# Altium schematic sheet 01_main.SchDoc: <Titel>
size A4; Date: <Erstelldatum>; DrawnBy: <Autor>; Organization: HSLU T&A; Address1: Abteilung Elektrotechnik; Address2: Technikumsstrasse 21; Address3: CH-6048 Horw; Revision: V1.0; SheetNumber: 1; SheetTotal: 1; Projektname: <Projektname>
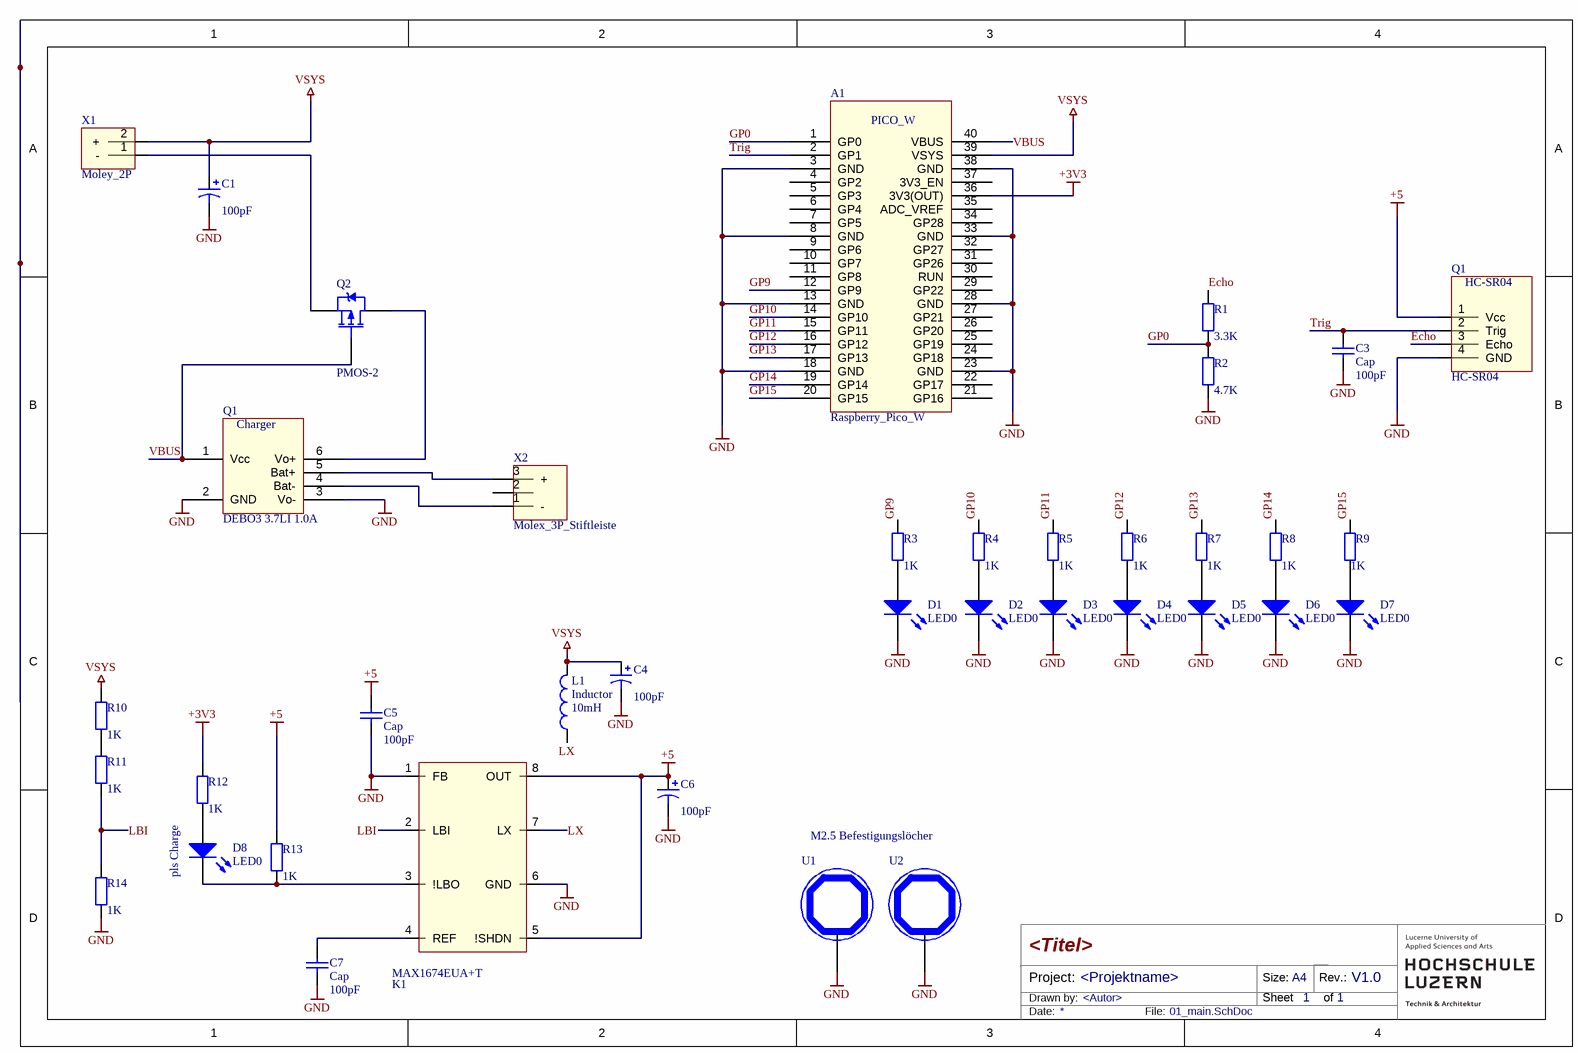
[diagram p0: 01_main.SchDoc]

## Parts
(Parts that share a designator on the sheet are numbered #1, #2 ... from top to bottom, then left to right.)
A1  Raspberry_Pico_W  [Raspi_Pico]
C1  value 100pF  [Elko_5mm]  (hidden comment: Cap Pol1)
C3  Cap  value 100pF  [C0603]
C4  value 100pF  [Elko_5mm]  (hidden comment: Cap Pol1)
C5  Cap  value 100pF  [C0603]
C6  value 100pF  [Elko_5mm]  (hidden comment: Cap Pol1)
C7  Cap  value 100pF  [C0603]
D1  LED0  [LED_5mm]
D2  LED0  [LED_5mm]
D3  LED0  [LED_5mm]
D4  LED0  [LED_5mm]
D5  LED0  [LED_5mm]
D6  LED0  [LED_5mm]
D7  LED0  [LED_5mm]
D8  LED0  [LED_5mm]
K1  MAX1674EUA+T  [uMAX_SOP8]
L1  Inductor  value 10mH  [AXIAL-0.5]
Q1#1  HC-SR04  [HC-SR04]
Q1#2  DEBO3 3.7LI 1.0A  [TP4056]
Q2  PMOS-2  [SOT-23]
R1  value 3.3K  [R0603]  (hidden comment: Res2)
R2  value 4.7K  [R0603]  (hidden comment: Res2)
R3  value 1K  [R0603]  (hidden comment: Res2)
R4  value 1K  [R0603]  (hidden comment: Res2)
R5  value 1K  [R0603]  (hidden comment: Res2)
R6  value 1K  [R0603]  (hidden comment: Res2)
R7  value 1K  [R0603]  (hidden comment: Res2)
R8  value 1K  [R0603]  (hidden comment: Res2)
R9  value 1K  [R0603]  (hidden comment: Res2)
R10  value 1K  [R0603]  (hidden comment: Res2)
R11  value 1K  [R0603]  (hidden comment: Res2)
R12  value 1K  [R0603]  (hidden comment: Res2)
R13  value 1K  [R0603]  (hidden comment: Res2)
R14  value 1K  [R0603]  (hidden comment: Res2)
U1  (no value)  [HoleM2.5]
U2  (no value)  [HoleM2.5]
X1  Moley_2P  [Molex Header 2P90]
X2  Molex_3P_Stiftleiste  [Molex_3P_Stiftleister]

## Nets
+3V3: A1.36(3V3(OUT)) R12.1
+5: C5.1 C6.1 K1.5(!SHDN) K1.8(OUT) Q1#1.1(Vcc) R13.1
GND: A1.3(GND) A1.8(GND) A1.13(GND) A1.18(GND) A1.23(GND) A1.28(GND) A1.33(GND) A1.38(GND) C1.2 C3.1 C4.2 C5.2 C6.2 C7.1 D1.2(K) D2.2(K) D3.2(K) D4.2(K) D5.2(K) D6.2(K) D7.2(K) K1.1(FB) K1.6(GND) Q1#1.4(GND) Q1#2.2(GND) Q1#2.3(Vo-) R2.2 R14.2 U1.?1 U2.?1
VSYS: A1.39(VSYS) C1.1 C4.1 L1.2 R10.1 X1.2(+)
Echo: Q1#1.3(Echo) R1.1
GP0: A1.1(GP0) R1.2 R2.1
GP9: A1.12(GP9) R3.1
GP10: A1.14(GP10) R4.1
GP11: A1.15(GP11) R5.1
GP12: A1.16(GP12) R6.1
GP13: A1.17(GP13) R7.1
GP14: A1.19(GP14) R8.1
GP15: A1.20(GP15) R9.1
LBI: K1.2(LBI) R11.2 R14.1
LX: K1.7(LX) L1.1
Trig: A1.2(GP1) C3.2 Q1#1.2(Trig)
VBUS: A1.40(VBUS) Q1#2.1(Vcc) Q2.1(G)
NetC7_2: C7.2 K1.4(REF)
NetD1_1: D1.1(A) R3.2
NetD2_1: D2.1(A) R4.2
NetD3_1: D3.1(A) R5.2
NetD4_1: D4.1(A) R6.2
NetD5_1: D5.1(A) R7.2
NetD6_1: D6.1(A) R8.2
NetD7_1: D7.1(A) R9.2
NetD8_1: D8.1(A) R12.2
NetD8_2: D8.2(K) K1.3(!LBO) R13.2
NetQ1#2_4: Q1#2.4(Bat-) X2.1(-)
NetQ1#2_5: Q1#2.5(Bat+) X2.3(+)
NetQ1#2_6: Q1#2.6(Vo+) Q2.2(D)
NetQ2_3: Q2.3(S) X1.1(-)
NetR10_2: R10.2 R11.1

Not connected (* = marked no-connect by the designer): A1 4(GP2) 5(GP3) 6(GP4) 7(GP5) 9(GP6) 10(GP7) 11(GP8) 21(GP16) 22(GP17) 24(GP18) 25(GP19) 26(GP20) 27(GP21) 29(GP22) 30(RUN) 31(GP26) 32(GP27) 34(GP28) 35(ADC_VREF) 37(3V3_EN); X2 2

## Notes on the sheet
- M2.5 Befestigungslöcher
- pls Charge
- Project:
- Drawn by:
- Size:
- Sheet
- A4
- Rev.:
- of
- Date:
- File:
- (in symbol DEBO3 3.7LI 1.0A) Charger
- (in symbol Raspberry_Pico_W) PICO_W

## Library data of the parts
C1 C4 C6 = Cap Pol1: Polarized Capacitor (Radial); Published: 8-Jun-2000; LatestRevisionDate: 17-Jul-2002; LatestRevisionNote: Re-released for DXP Platform.; PackageReference: RB7.6-15; Publisher: Altium Limited; PackageDescription: Polarized Capacitor (Radial); 2 Leads
C3 C5 C7 = Cap: Capacitor; Published: 8-Jun-2000; LatestRevisionDate: 17-Jul-2002; LatestRevisionNote: Re-released for DXP Platform.; PackageReference: RAD-0.3; Publisher: Altium Limited; PackageDescription: Radial Cap, Thru-Hole; 2 Leads; 0.3 in Pin Spacing
D1-D8 = LED0: Typical INFRARED GaAs LED; Published: 8-Jun-2000; LatestRevisionDate: 08-Jul-2005; LatestRevisionNote: Mech Layer 1 removed.; PackageReference: LED-0; Publisher: Altium Limited; PackageDescription: LED; 2 Leads
K1 = MAX1674EUA+T: Step-Up DC-DC Converter
L1 = Inductor: Code_IEC: 1005; Published: 8-Jun-2000; LatestRevisionDate: 29-May-2009; LatestRevisionNote: IPC-7351 Footprint Added.; PackageReference: 0402-A; Publisher: Altium Limited; PackageDescription: Chip Inductor; Code_JEITA: 0402
Q2 = PMOS-2: P-Channel Power MOSFET; Note: Pin 4 not drawn and electrically connected to Pin 2.; Published: 8-Jun-2000; LatestRevisionDate: 17-Jul-2002; LatestRevisionNote: Re-released for DXP Platform.; DatasheetVersion: PD-9.390D; PackageVersion: Feb-1997; PackageReference: TO-220AB; Publisher: Altium Limited; PackageDescription: TO, Thru-Hole, Vertical, Heatsink Mounted; 3 In-Line Leads; Pitch 2.54 mm; ComponentLink1Description: Manufacturer Link; ComponentLink1URL: http://www.irf.com/
R1-R14 = Res2: Resistor; Published: 8-Jun-2000; LatestRevisionDate: 17-Jul-2002; LatestRevisionNote: Re-released for DXP Platform.; PackageReference: AXIAL-0.4; Publisher: Altium Limited; PackageDescription: Axial Device, Thru-Hole; 2 Leads; 0.4 in Pin Spacing
U1 U2 = Mountinghole